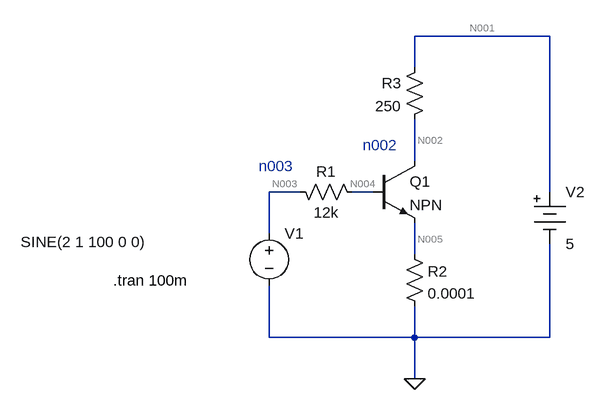
[diagram p0: schematic Yoneda-p102__Transistor_Amplify__v2_AsText.asc]
Yoneda-p102__Transistor_Amplify__v2_AsText.asc, the LTspice schematic file:
Version 4
SHEET 1 880 680
WIRE 496 -176 288 -176
WIRE 288 -128 288 -176
WIRE 288 16 288 -48
WIRE 112 64 64 64
WIRE 224 64 192 64
WIRE 496 64 496 -176
WIRE 64 128 64 64
WIRE 288 160 288 112
WIRE 64 288 64 208
WIRE 288 288 288 240
WIRE 288 288 64 288
WIRE 496 288 496 144
WIRE 496 288 288 288
WIRE 288 352 288 288
FLAG 288 352 0
SYMBOL res 208 80 M270
WINDOW 0 32 56 VTop 2
WINDOW 3 0 56 VBottom 2
SYMATTR InstName R1
SYMATTR Value 12k
SYMBOL res 272 144 R0
WINDOW 0 36 42 Left 2
SYMATTR InstName R2
SYMATTR Value 0.0001
SYMBOL Misc\\battery 496 48 R0
SYMATTR InstName V2
SYMATTR Value 5
SYMBOL npn 224 16 R0
SYMATTR InstName Q1
SYMBOL voltage 64 112 R0
WINDOW 3 -382 29 Left 2
WINDOW 123 0 0 Left 2
WINDOW 39 0 0 Left 2
SYMATTR Value SINE(2 1 100 0 0)
SYMATTR InstName V1
SYMBOL res 304 -144 M0
SYMATTR InstName R3
SYMATTR Value 250
TEXT -176 200 Left 2 !.tran 100m
TEXT 208 -8 Left 2 ;n002
TEXT 48 24 Left 2 ;n003

The netlist it stands for:
* Yoneda-p102__Transistor_Amplify__v2_AsText.asc
R1 N004 N003 12k
R2 N005 0 0.0001
V2 N001 0 5
Q1 N002 N004 N005 0 NPN
V1 N003 0 SINE(2 1 100 0 0)
R3 N001 N002 250
.model NPN NPN
.model PNP PNP
.lib standard.bjt
.tran 100m
* n002
* n003
.backanno
.end

* Results of the author's LTspice run, read from the files saved beside the schematic
* Operating Point, zero values left out:
*   V(n004) = 833.1 mV
*   V(n003) = 2 V
*   V(n005) = 982.2 nV
*   V(n001) = 5 V
*   V(n002) = 2.569 V
*   Ic(Q1) = 9.724 mA
*   Ib(Q1) = 97.24 µA
*   Ie(Q1) = -9.822 mA
*   I(R3) = 9.724 mA
*   I(R2) = 9.822 mA
*   I(R1) = -97.24 µA
*   I(V1) = -97.24 µA
*   I(V2) = -9.724 mA
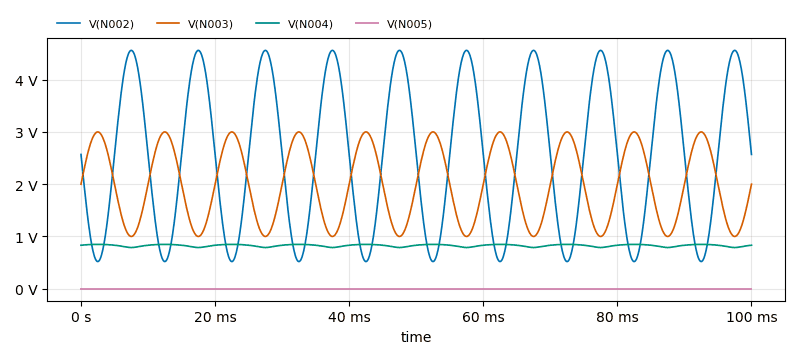
[diagram p1: Transient Analysis of Yoneda-p102__Transistor_Amplify__v2_AsText.asc, plotted from the saved traces]
* Transient Analysis, 1 run:
*   V(N002): min 520.5 mV, max 4.558 V, average 2.556 V, rms 2.932 V, last 2.569 V
*   V(N003): min 1.001 V, max 2.999 V, average 2 V, rms 2.122 V, last 2 V
*   V(N004): min 789 mV, max 848.9 mV, average 826.8 mV, rms 827.1 mV, last 833.1 mV
*   V(N005): min 178.4 nV, max 1.81 µV, average 987.4 nV, rms 1.145 µV, last 982.2 nV